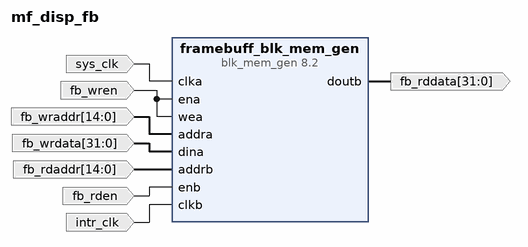
[diagram p0: block diagram of the top level]
# Vivado block design mf_disp_fb, Vivado 2014.4
create_bd_design mf_disp_fb

create_bd_port -dir I -type clk sys_clk
set_property -dict {CONFIG.FREQ_HZ 50000000} [get_bd_ports sys_clk]
create_bd_port -dir I fb_wren
create_bd_port -dir I -from 14 -to 0 fb_wraddr
create_bd_port -dir I -from 31 -to 0 fb_wrdata
create_bd_port -dir I -from 14 -to 0 fb_rdaddr
create_bd_port -dir O -from 31 -to 0 fb_rddata
create_bd_port -dir I fb_rden
create_bd_port -dir I intr_clk

create_bd_cell -type ip -vlnv xilinx.com:ip:blk_mem_gen:8.2 framebuff_blk_mem_gen
set_property -dict [list \
  CONFIG.Memory_Type Simple_Dual_Port_RAM \
  CONFIG.Enable_32bit_Address false \
  CONFIG.Use_Byte_Write_Enable false \
  CONFIG.Write_Depth_A 32000 \
  CONFIG.Operating_Mode_A NO_CHANGE \
  CONFIG.Write_Width_B 32 \
  CONFIG.Read_Width_B 32 \
  CONFIG.Enable_B Use_ENB_Pin \
  CONFIG.Register_PortB_Output_of_Memory_Primitives true \
  CONFIG.Port_B_Clock 100 \
  CONFIG.Port_B_Enable_Rate 100 \
  CONFIG.use_bram_block Stand_Alone \
] [get_bd_cells framebuff_blk_mem_gen]

# ---- connections ----

connect_bd_net [get_bd_ports sys_clk] [get_bd_pins framebuff_blk_mem_gen/clka]
connect_bd_net [get_bd_ports fb_wren] [get_bd_pins framebuff_blk_mem_gen/ena] [get_bd_pins framebuff_blk_mem_gen/wea]
connect_bd_net [get_bd_ports fb_wraddr] [get_bd_pins framebuff_blk_mem_gen/addra]
connect_bd_net [get_bd_ports fb_wrdata] [get_bd_pins framebuff_blk_mem_gen/dina]
connect_bd_net [get_bd_ports fb_rdaddr] [get_bd_pins framebuff_blk_mem_gen/addrb]
connect_bd_net [get_bd_pins framebuff_blk_mem_gen/doutb] [get_bd_ports fb_rddata]
connect_bd_net [get_bd_ports fb_rden] [get_bd_pins framebuff_blk_mem_gen/enb]
connect_bd_net [get_bd_ports intr_clk] [get_bd_pins framebuff_blk_mem_gen/clkb]

validate_bd_design
save_bd_design
